# EAGLE design First_Board (EAGLE 6.0)
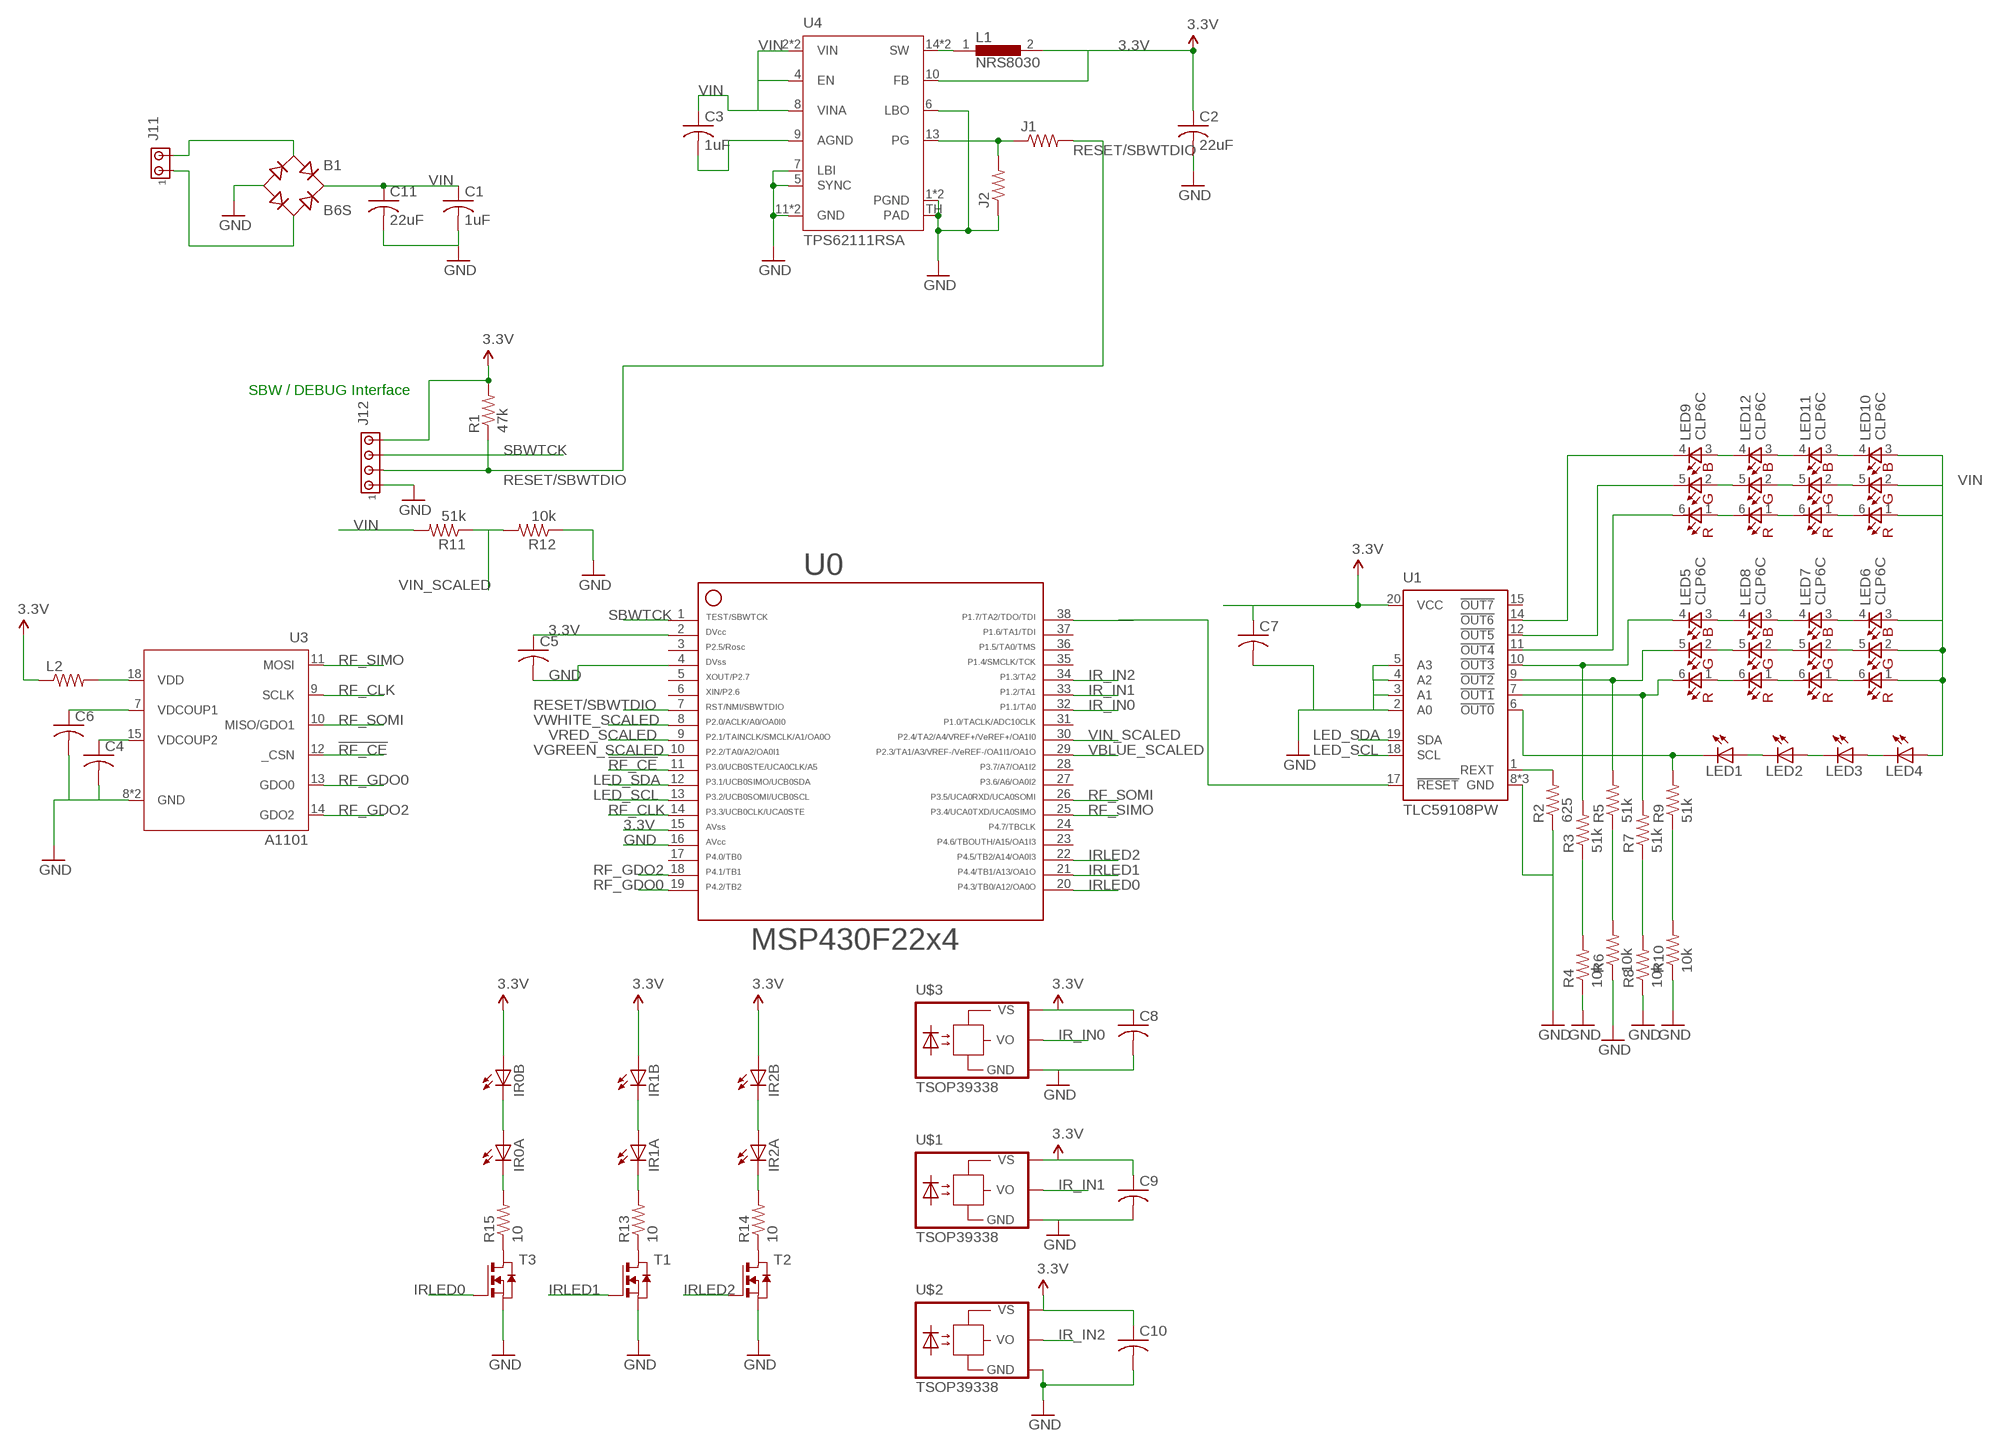
[diagram p0: schematic, sheet 1]

## Parts
B1  B6S  [MBS]
C1  1uF  C-USC0805  [C0805]
C2  22uF  C-USC0805  [C0805]
C3  1uF  C-USC0603  [C0603]
C4  C-USC0603  [C0603]
C5  C-USC0603  [C0603]
C6  C-USC0603  [C0603]
C7  C-USC0603  [C0603]
C8  C-USC0603  [C0603]
C9  C-USC0603  [C0603]
C10  C-USC0603  [C0603]
C11  22uF  C-USC1210  [C1210]
IR0A  LED5MM  [LED5MM]
IR0B  LED5MM  [LED5MM]
IR1A  LED5MM  [LED5MM]
IR1B  LED5MM  [LED5MM]
IR2A  LED5MM  [LED5MM]
IR2B  LED5MM  [LED5MM]
J1  R-US_R0603  [R0603]
J2  R-US_R0603  [R0603]
J11  MTA02-100  [10X02MTA]
J12  MTA04-100  [10X04MTA]
L1  NRS8030  [NRS8030]
L2  R-US_R0603  [R0603]
LED1  LED-2AC-SUPERFLUX  [SUPERFLUX-7.6X7.6]
LED2  LED-2AC-SUPERFLUX  [SUPERFLUX-7.6X7.6]
LED3  LED-2AC-SUPERFLUX  [SUPERFLUX-7.6X7.6]
LED4  LED-2AC-SUPERFLUX  [SUPERFLUX-7.6X7.6]
LED5  CLP6C  [CLP6C]
LED6  CLP6C  [CLP6C]
LED7  CLP6C  [CLP6C]
LED8  CLP6C  [CLP6C]
LED9  CLP6C  [CLP6C]
LED10  CLP6C  [CLP6C]
LED11  CLP6C  [CLP6C]
LED12  CLP6C  [CLP6C]
R1  47k  R-US_R0603  [R0603]
R2  625  R-US_R0603  [R0603]
R3  51k  R-US_R0603  [R0603]
R4  10k  R-US_R0603  [R0603]
R5  51k  R-US_R0603  [R0603]
R6  10k  R-US_R0603  [R0603]
R7  51k  R-US_R0603  [R0603]
R8  10k  R-US_R0603  [R0603]
R9  51k  R-US_R0603  [R0603]
R10  10k  R-US_R0603  [R0603]
R11  51k  R-US_R0603  [R0603]
R12  10k  R-US_R0603  [R0603]
R13  10  R-US_R0603  [R0603]
R14  10  R-US_R0603  [R0603]
R15  10  R-US_R0603  [R0603]
T1  NMOSSOT23  [SOT-23]
T2  NMOSSOT23  [SOT-23]
T3  NMOSSOT23  [SOT-23]
U0  F22X4---DA38  [DA38]
U1  TLC59108PW  [PW_R-PDSO-G20]
U3  A1101  [A1101]
U4  TPS62111RSA  [S-PVQFN-N16]
U$1  TSOP39338  [TSOP39338]
U$2  TSOP39338  [TSOP39338]
U$3  TSOP39338  [TSOP39338]

## Nets
3.3V: C2.1 C5.1 C7.1 C8.1 C9.1 C10.1 IR0B.A IR1B.A IR2B.A J12.4 L1.2 L2.1 R1.2 U0.2 U0.15 U1.20(VCC) U4.10(FB) U$1.VS U$2.VS U$3.VS
!RF_CE: U0.11 U3.12(_CSN)
BLUE: LED5.4(BC) R3.2 U1.10(!OUT3)
BLUE2: LED9.4(BC) U1.14(!OUT6)
GND: B1.- C1.2 C2.2 C4.2 C5.2 C6.2 C7.2 C8.2 C9.2 C10.2 C11.2 J2.1 J12.1 R2.1 R4.1 R6.1 R8.1 R10.1 R12.1 T1.2(S) T2.2(S) T3.2(S) U0.4 U0.16 U1.2(A0) U1.3(A1) U1.4(A2) U1.5(A3) U1.8(GND) U1.13(GND) U1.16(GND) U3.8(GND) U3.17(GND) U4.1(PGND) U4.5(SYNC) U4.6(LBO) U4.7(LBI) U4.11(GND) U4.12(GND) U4.16(PGND) U4.TH(PAD) U$1.GND U$2.GND U$3.GND
GREEN: LED5.5(GC) R5.2 U1.9(!OUT2)
GREEN2: LED9.5(GC) U1.12(!OUT5)
IR_IN0: U0.32 U$3.OUT(VO)
IR_IN1: U0.33 U$1.OUT(VO)
IR_IN2: U0.34 U$2.OUT(VO)
IRLED0: T3.3(G) U0.20
IRLED1: T1.3(G) U0.21
IRLED2: T2.3(G) U0.22
LED_SCL: U0.13 U1.18(SCL)
LED_SDA: U0.12 U1.19(SDA)
N$1: L1.1 U4.14(SW) U4.15(SW)
N$2: IR2A.K(C) R14.2
N$3: IR2A.A IR2B.K(C)
N$4: IR1A.A IR1B.K(C)
N$5: IR1A.K(C) R13.2
N$6: R13.1 T1.1(D)
N$7: U0.38
N$8: C3.2 U4.9(AGND)
N$9: R14.1 T2.1(D)
N$10: LED1.1(C) LED1.3(C) R9.2 U1.6(!OUT0)
N$12: LED9.3(BA) LED12.4(BC)
N$13: LED11.4(BC) LED12.3(BA)
N$14: LED10.4(BC) LED11.3(BA)
N$15: LED10.5(GC) LED11.2(GA)
N$16: LED11.5(GC) LED12.2(GA)
N$17: LED9.2(GA) LED12.5(GC)
N$18: LED9.1(RA) LED12.6(RC)
N$19: R2.2 U1.1(REXT)
N$20: LED11.6(RC) LED12.1(RA)
N$21: LED10.6(RC) LED11.1(RA)
N$22: IR0A.K(C) R15.2
N$23: IR0A.A IR0B.K(C)
N$24: R15.1 T3.1(D)
N$25: LED5.3(BA) LED8.4(BC)
N$26: LED7.4(BC) LED8.3(BA)
N$27: LED6.4(BC) LED7.3(BA)
N$28: LED6.5(GC) LED7.2(GA)
N$29: LED7.5(GC) LED8.2(GA)
N$30: LED5.2(GA) LED8.5(GC)
N$31: LED5.1(RA) LED8.6(RC)
N$32: LED7.6(RC) LED8.1(RA)
N$33: LED6.6(RC) LED7.1(RA)
N$34: LED1.2(A) LED1.4(A) LED2.1(C) LED2.3(C)
N$35: LED2.2(A) LED2.4(A) LED3.1(C) LED3.3(C)
N$36: LED3.2(A) LED3.4(A) LED4.1(C) LED4.3(C)
N$38: U1.17(!RESET)
N$39: B1.AC1 J11.2
N$40: B1.AC2 J11.1
N$42: L2.2 U3.18(VDD)
PG: J1.1 J2.2 U4.13(PG)
RED: LED5.6(RC) R7.2 U1.7(!OUT1)
RED2: LED9.6(RC) U1.11(!OUT4)
RESET/SBWTDIO: J1.2 J12.2 R1.1 U0.7
RF_CLK: U0.14 U3.9(SCLK)
RF_GDO0: U0.19 U3.13(GDO0)
RF_GDO2: U0.18 U3.14(GDO2)
RF_SIMO: U0.25 U3.11(MOSI)
RF_SOMI: U0.26 U3.10(MISO/GDO1)
SBWTCK: J12.3 U0.1
VBLUE_SCALED: R3.1 R4.2 U0.29
VDCOUP1: C6.1 U3.7(VDCOUP1)
VDCOUP2: C4.1 U3.15(VDCOUP2)
VGREEN_SCALED: R5.1 R6.2 U0.10
VIN: B1.+ C1.1 C3.1 C11.1 LED4.2(A) LED4.4(A) LED6.1(RA) LED6.2(GA) LED6.3(BA) LED10.1(RA) LED10.2(GA) LED10.3(BA) R11.2 U4.2(VIN) U4.3(VIN) U4.4(EN) U4.8(VINA)
VIN_SCALED: R11.1 R12.2 U0.30
VRED_SCALED: R7.1 R8.2 U0.9
VWHITE_SCALED: R9.1 R10.2 U0.8
Unconnected: U0.3 U0.5 U0.6 U0.17 U0.23 U0.24 U0.27 U0.28 U0.31 U0.35 U0.36 U0.37 U1.15(!OUT7)

## Notes on the sheet
- SBW / DEBUG Interface

## Library data of the parts
B1 = rectifier:B*S: Surface Mount Glass Passivated Bridge Rectifiers Source: Comchip Bridge Rectifiers B05S-G_B10S-G.pdf
C1-C11 = rcl:C-US: CAPACITOR, American symbol
IR0A IR0B IR1A IR1B IR2A IR2B = led:LED: LED OSRAM: - CHIPLED LG R971, LG N971, LY N971, LG Q971, LY Q971, LO R971, LY R971 LH N974, LH R974 LS Q976, LO Q976, LY Q976 LO Q996 - Hyper CHIPLED LW Q18S LB Q993, LB Q99A, LB R99A - SideLED LS A670, LO A670, LY A670, LG A670, LP A670 LB A673, LV A673, LT A673, LW A673 LH A674 LY A675 LS A676, LA A676, LO A676, LY A676, LW A676 LS A679, LY A679, LG A679 - Hyper Micro SIDELED® LS Y876, LA Y876, LO Y876, LY Y876 LT Y87S - SmartLED LW L88C, LW L88S LB L89C, LB L89S, LG L890 LS L89K, LO L89K, LY L89K LS L896, LA L896, LO L896, LY L896 - TOPLED LS T670, LO T670, LY T670, LG T670, LP T670 LSG T670, LSP T670, LSY T670, LOP T670, LYG T670 LG T671, LOG T671, LSG T671 LB T673, LV T673, LT T673, LW T673 LH T674 LS T676, LA T676, LO T676, LY T676, LB T676, LH T676, LSB T676, LW T676 LB T67C, LV T67C, LT T67C, LS T67K, LO T67K, LY T67K, LW E67C LS E67B, LA E67B, LO E67B, LY E67B, LB E67C, LV E67C, LT E67C LW T67C LS T679, LY T679, LG T679 LS T770, LO T770, LY T770, LG T770, LP T770 LB T773, LV T773, LT T773, LW T773 LH T774 LS E675, LA E675, LY E675, LS T675 LS T776, LA T776, LO T776, LY T776, LB T776 LHGB T686 LT T68C, LB T68C - Hyper Mini TOPLED® LB M676 - Mini TOPLED Santana® LG M470 LS M47K, LO M47K, LY M47K Source: http://www.osram.convergy.de LUXEON: - LUMILED® LXK2-PW12-R00, LXK2-PW12-S00, LXK2-PW14-U00, LXK2-PW14-V00 LXK2-PM12-R00, LXK2-PM12-S00, LXK2-PM14-U00 LXK2-PE12-Q00, LXK2-PE12-R00, LXK2-PE12-S00, LXK2-PE14-T00, LXK2-PE14-U00 LXK2-PB12-K00, LXK2-PB12-L00, LXK2-PB12-M00, LXK2-PB14-N00, LXK2-PB14-P00, LXK2-PB14-Q00 LXK2-PR12-L00, LXK2-PR12-M00, LXK2-PR14-Q00, LXK2-PR14-R00 LXK2-PD12-Q00, LXK2-PD12-R00, LXK2-PD12-S00 LXK2-PH12-R00, LXK2-PH12-S00 LXK2-PL12-P00, LXK2-PL12-Q00, LXK2-PL12-R00 Source: www.luxeon.com KINGBRIGHT: KA-3528ASYC Source: www.kingbright.com
J1 J2 L2 R1-R15 = rcl:R-US_: RESISTOR, American symbol
J11 = con-amp:MTA02-100: AMP connector
J12 = con-amp:MTA04-100: AMP connector
L1 = inductors:NRS8030
LED1-LED4 = led:LED-2AC-: LEDs with 2 Cathode & 2 Anode - Kingbright SUPER FLUX LED LAMP Source: www.us.kingbright.com/images/catalog/SPEC/W7676CPBC-H.pdf Cree® P4 LED CP41B-WES/WGS Source: Data sheet <http://www.cree.com/products/pdf/LEDlamps/CP41B-WES&WGS.pdf>
LED5-LED12 = led:CLP6C
T1-T3 = zetex:NMOSSOT23: MOS FET; OC_FARNELL: unknown; OC_NEWARK: unknown
U0 = TI_MSP430_v16:F22X4---DA38: ***MSP430F22x4***DA38
U1 = texas:TLC59108
U3 = anaren:A1101
U4 = texas2:TPS62111: TPS62111 3.3v Buck Regulator (5.5-17V input)
U$1-U$3 = opto-vishay:TSOP39338

## Board
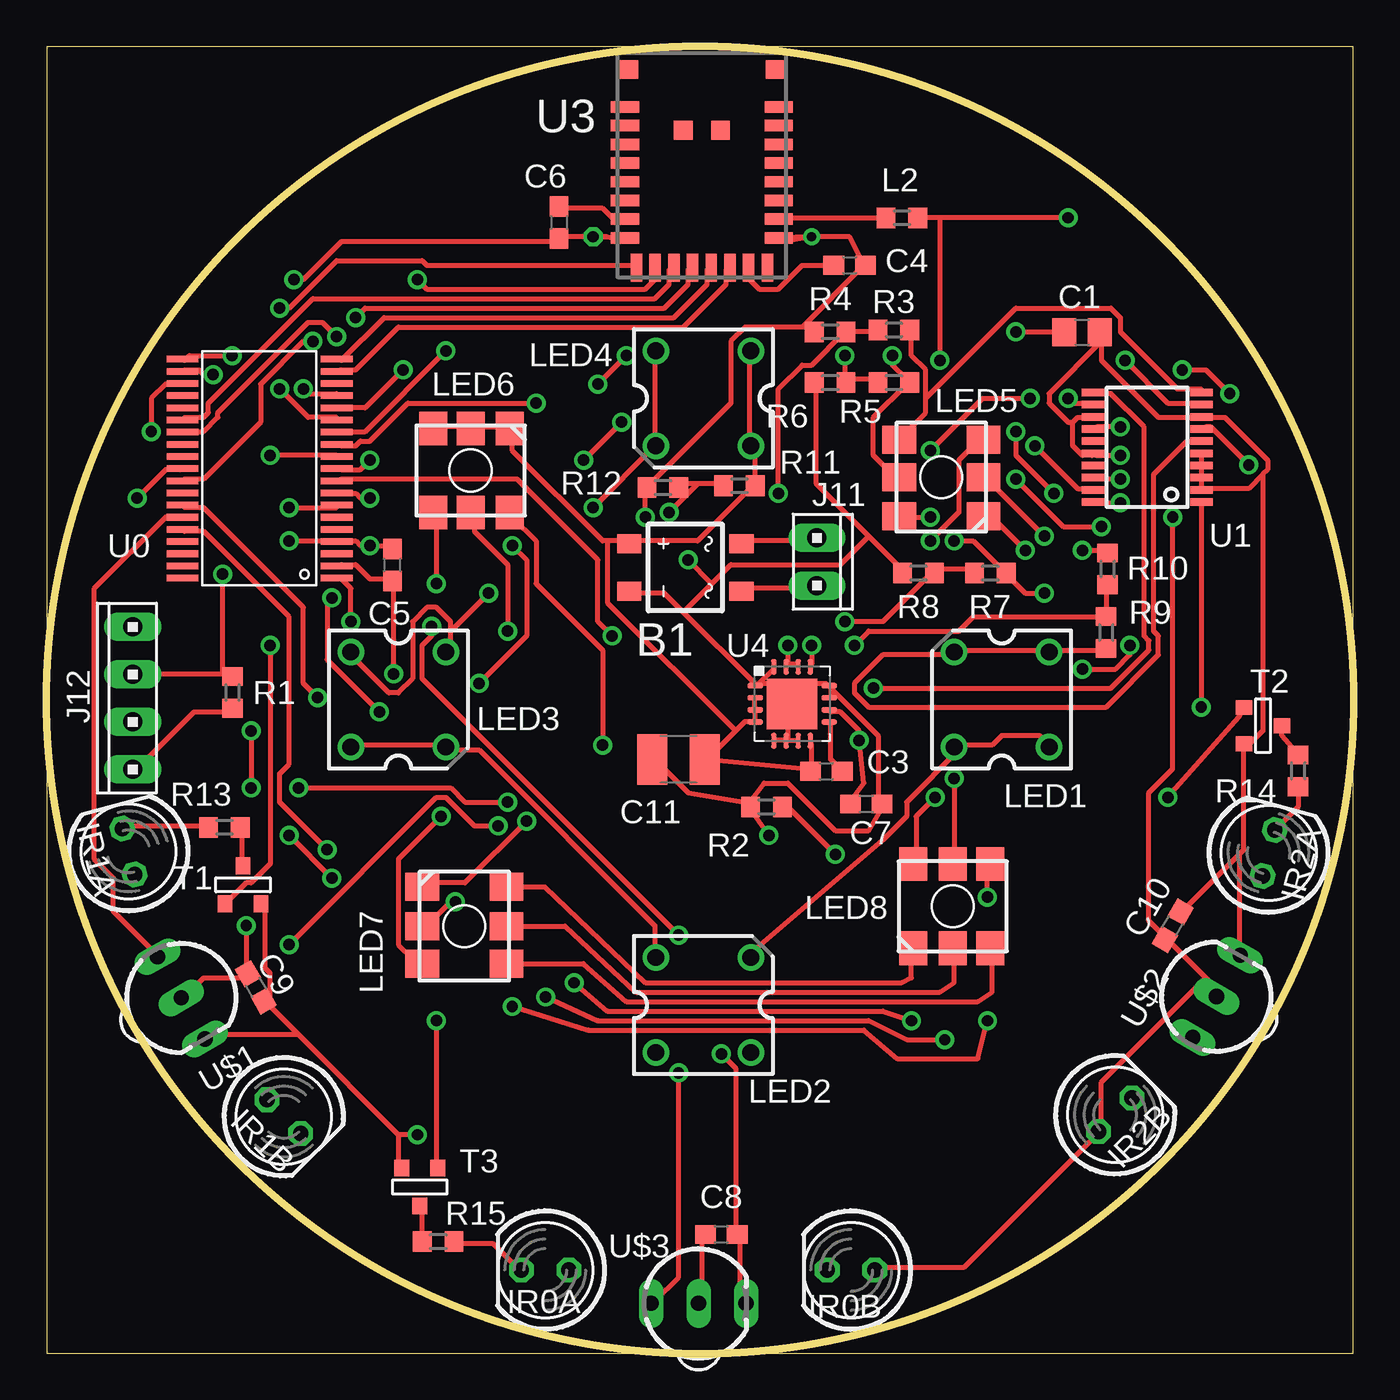
[diagram p1: board, top side]
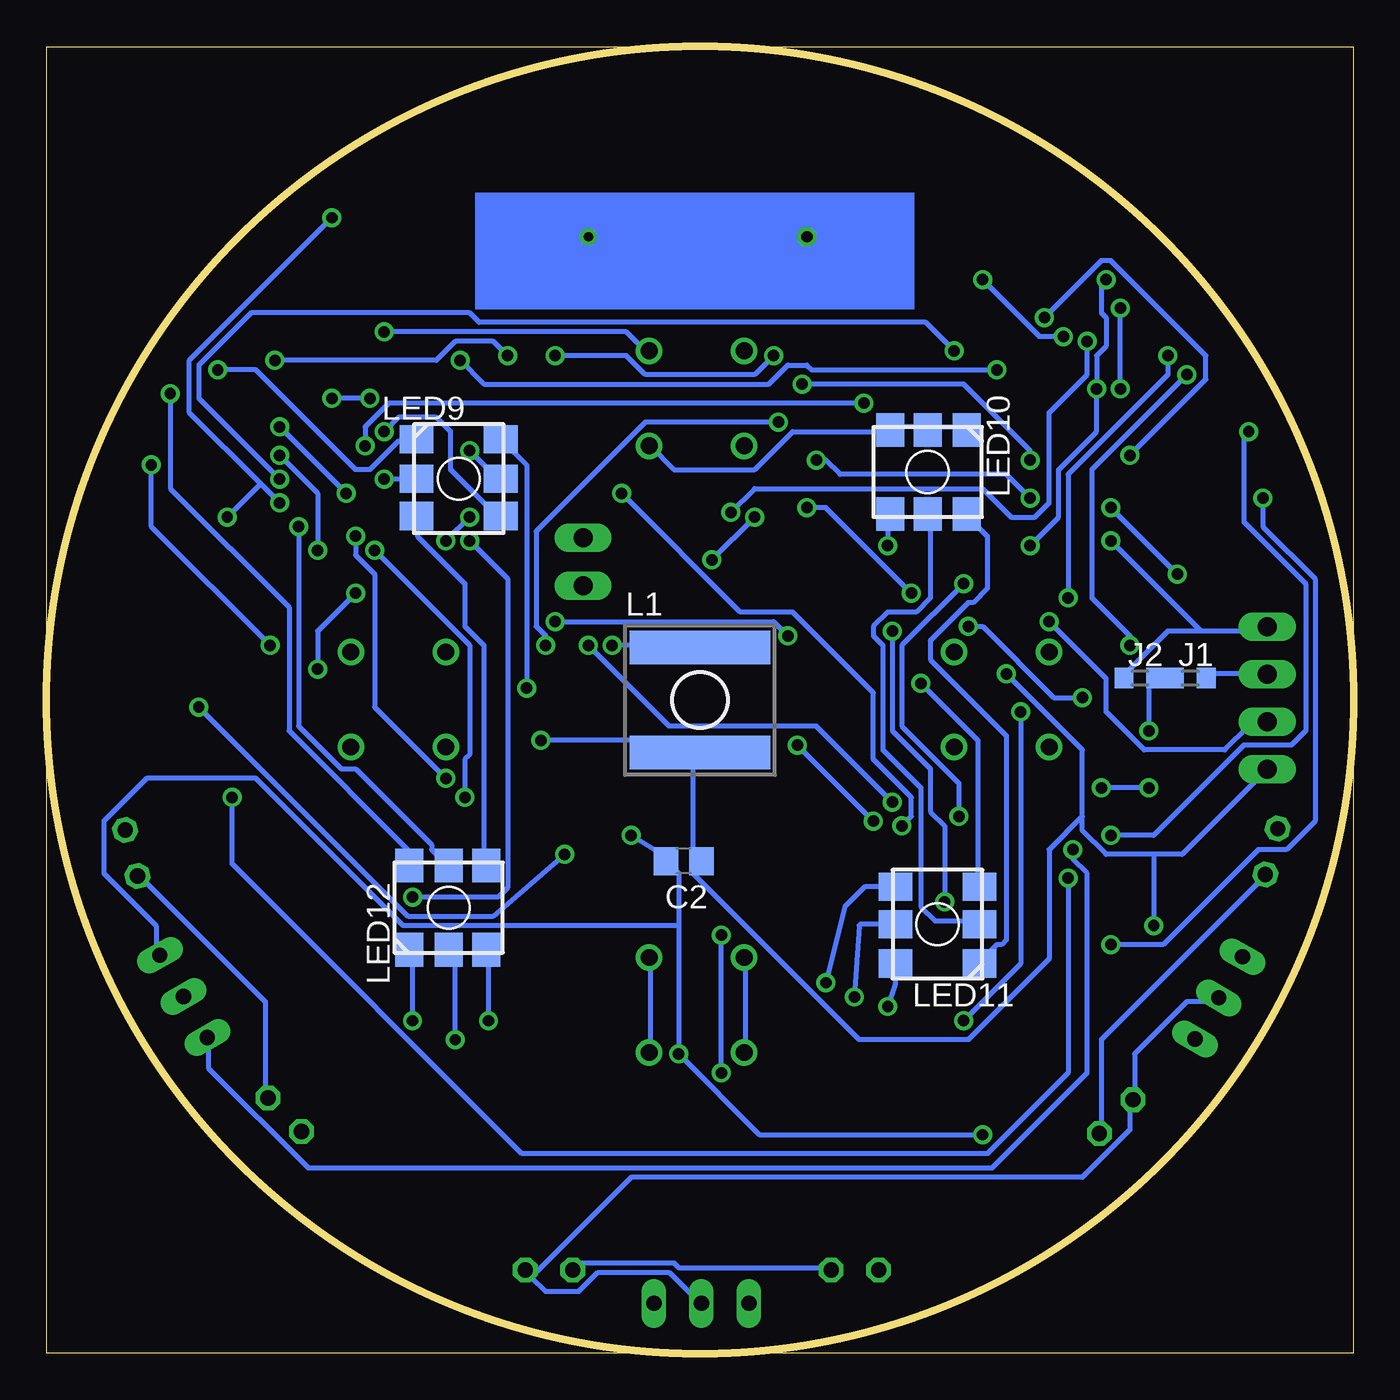
[diagram p2: board, bottom side, seen from below]

Size 69.85 x 69.85 mm. Coordinates in mm from the lower left corner, seen from the top.
Outline: 0,0 69.85,0 69.85,69.85 0,69.85 0,0
Outline: circle at 34.92,34.92 radius 34.92
Copper layers (1*16): Top 0.035mm / dielectric 1.5mm / Bottom 0.035mm
Design rules: minimum track width 10mil, minimum drill 24mil, track to track 8mil, track to pad 8mil, pad to pad 8mil, via to via 8mil, smd to smd 8mil, copper to edge 40mil, drill to drill 10mil, minimum pad ring 10mil, minimum via ring 8mil, stop-mask expansion 0mil, vias tented up to drill 0mil, thermal gap 10mil
bRestrict: area 13,62.2 to 56.4,70.1

### Footprints (pad centres in the part's own frame; a part is rotated, then mirrored left to right if it is on the bottom)
MBS = smd 1 x 1.3: + -1.27,-3; - 1.27,-3; AC1 -1.27,3; AC2 1.27,3
C0805 = smd 1.3 x 1.5: 1 -0.95,0; 2 0.95,0
C0603 = smd 1.1 x 1: 1 -0.85,0; 2 0.85,0
C1210 = smd 1.6 x 2.7: 1 -1.4,0; 2 1.4,0
LED5MM = drill 0.813 octagon: A -1.27,0; K 1.27,0
R0603 = smd 1 x 1.1: 1 -0.85,0; 2 0.85,0
10X02MTA = drill 1.016 long: 1 1.27,0; 2 -1.27,0
10X04MTA = drill 1.016 long: 1 3.81,0; 2 1.27,0; 3 -1.27,0; 4 -3.81,0
NRS8030 = smd 7.5 x 1.8: 1 0,2.8; 2 0,-2.8
SUPERFLUX-7.6X7.6 = drill 0.9 pad 1.422: 1 -2.54,2.54; 2 2.54,2.54; 3 -2.54,-2.54; 4 2.54,-2.54
CLP6C = smd 1.8 x 1.5: 1 -2.25,2.1; 2 -2.25,0; 3 -2.25,-2; 4 2.25,-2; 5 2.25,0; 6 2.25,2.1
SOT-23 = smd 0.787 x 0.889: 1 0.025,-1.016; 2 -0.94,1.016; 3 0.991,1.016
DA38 = smd 0.35 x 1.705: 1 -5.85,-4.12; 2 -5.2,-4.12; 3 -4.55,-4.12; 4 -3.9,-4.12; 5 -3.25,-4.12; 6 -2.6,-4.12; 7 -1.95,-4.12; 8 -1.3,-4.12; 9 -0.65,-4.12; 10 0,-4.12; 11 0.65,-4.12; 12 1.3,-4.12; 13 1.95,-4.12; 14 2.6,-4.12; 15 3.25,-4.12; 16 3.9,-4.12; 17 4.55,-4.12; 18 5.2,-4.12; 19 5.85,-4.12; 20 5.85,4.12; 21 5.2,4.12; 22 4.55,4.12; 23 3.9,4.12; 24 3.25,4.12; 25 2.6,4.12; 26 1.95,4.12; 27 1.3,4.12; 28 0.65,4.12; 29 0,4.12; 30 -0.65,4.12; 31 -1.3,4.12; 32 -1.95,4.12; 33 -2.6,4.12; 34 -3.25,4.12; 35 -3.9,4.12; 36 -4.55,4.12; 37 -5.2,4.12; 38 -5.85,4.12
PW_R-PDSO-G20 = smd 0.4 x 1.2: 1 -2.925,-2.9; 2 -2.275,-2.9; 3 -1.625,-2.9; 4 -0.975,-2.9; 5 -0.325,-2.9; 6 0.325,-2.9; 7 0.975,-2.9; 8 1.625,-2.9; 9 2.275,-2.9; 10 2.925,-2.9; 11 2.925,2.9; 12 2.275,2.9; 13 1.625,2.9; 14 0.975,2.9; 15 0.325,2.9; 16 -0.325,2.9; 17 -0.975,2.9; 18 -1.625,2.9; 19 -2.275,2.9; 20 -2.925,2.9
A1101 = smd 1.5 x 0.61: 1 -4.11,2.6; 2 -4.11,1.6; 3 -4.11,0.6; 4 -4.11,-0.4; 5 -4.11,-1.4; 6 -4.11,-2.4; 7 -4.11,-3.4; 8 -4.11,-4.4; 17 4.11,-4.4; 18 4.11,-3.4; 19 4.11,-2.4; 20 4.11,-1.4; 21 4.11,-0.4; 22 4.11,0.6; 23 4.11,1.6; 24 4.11,2.6 | smd 0.61 x 1.5: 9 -3.5,-6; 10 -2.5,-6; 11 -1.5,-6; 12 -0.5,-6; 13 0.5,-6; 14 1.5,-6; 15 2.5,-6; 16 3.5,-6 | smd 1 x 1: MECH1 -3.91,4.6; MECH2 -1,1.35; MECH3 1,1.35; MECH4 3.91,4.6
S-PVQFN-N16 = smd 0.85 x 0.3: 1 -1.975,0.975; 2 -1.975,0.325; 3 -1.975,-0.325; 4 -1.975,-0.975; 9 1.975,-0.975; 10 1.975,-0.325; 11 1.975,0.325; 12 1.975,0.975 | smd 0.3 x 0.85: 5 -0.975,-1.975; 6 -0.325,-1.975; 7 0.325,-1.975; 8 0.975,-1.975; 13 0.975,1.975; 14 0.325,1.975; 15 -0.325,1.975; 16 -0.975,1.975 | smd 2.7 x 2.7: TH 0,0
TSOP39338 = drill 0.813 long: GND 2.54,0; OUT -2.54,0; VS 0,0

### Placement (x,y rotation side)
B1  34.14,42.01 270 top
C1  55.35,54.58 0 top
C2  35.79,26.31 180 bottom
C3  41.68,31.11 0 top
C4  42.93,58.17 0 top
C5  18.49,42.14 90 top
C6  27.38,60.45 270 top
C7  43.81,29.36 0 top
C8  36.07,6.35 0 top
C9  11.18,19.56 300 top
C10  60.2,22.86 60 top
C11  33.78,31.75 180 top
IR0A  26.64,4.45 180 top
IR0B  43,4.45 180 top
IR1A  4.37,26.82 105 top
IR1B  12.67,12.65 315 top
IR2A  65.33,26.75 75 top
IR2B  57.12,12.75 45 top
J1  8.71,36.09 0 bottom
J2  11.4,36.09 0 bottom
J11  41.17,42.32 270 top
J12  4.6,35.03 90 top
L1  34.92,34.92 0 bottom
L2  45.72,60.71 180 top
LED1  51.05,34.95 270 top
LED2  35.1,18.62 180 top
LED3  18.8,34.95 90 top
LED4  35.1,51.05 0 top
LED5  47.83,46.84 180 top
LED6  22.66,47.19 270 top
LED7  22.33,22.83 0 top
LED8  48.44,23.9 90 top
LED9  47.83,46.76 0 bottom
LED10  22.76,47.12 270 bottom
LED11  22.23,22.94 180 bottom
LED12  48.36,23.83 90 bottom
R1  9.93,35.33 270 top
R2  38.48,29.21 0 top
R3  45.29,54.71 0 top
R4  41.88,54.61 0 top
R5  45.29,51.89 0 top
R6  41.88,51.89 0 top
R7  50.44,41.71 0 top
R8  46.61,41.71 0 top
R9  56.64,38.53 270 top
R10  56.72,41.94 270 top
R11  37.03,46.38 0 top
R12  32.94,46.28 0 top
R13  9.5,28.12 180 top
R14  66.9,31.14 270 top
R15  20.93,5.97 0 top
T1  10.52,25.04 180 top
T2  65.02,33.53 90 top
T3  19.91,8.89 0 top
U0  11.38,47.29 90 top
U1  58.83,48.44 90 top
U3  35.03,64.03 0 top
U4  39.85,34.72 0 top
U$1  7.19,19 300 top
U$2  62.53,19.08 60 top
U$3  34.85,2.67 0 top

### Tracks (layer width: path | path; a pad name or v marks a point on that pad's centre or on a via)
3.3V  (via drill 0.61)
  Top 0.254: v54.61,60.71 47.75,60.71 | 47.75,60.71 L2.1 | v57.4,45.47 56.13,45.47 U1.20 | v19.05,52.58 17.02,50.55 15.75,50.55 U0.15 | 47.75,60.71 v47.75,53.09 | 61.98,20.07 62.74,19.3 U$2.VS 61.98,20.07 | 61.98,20.07 59.94,22.1 C10.1 59.69,22.35 58.93,23.11 58.93,29.97 60.2,31.24 v60.2,44.7 | C8.1 35.05,6.35 35.05,2.79 U$3.VS | IR0B.A 44.45,4.57 49.02,4.57 56.13,11.68 IR2B.A 56.39,11.94 56.39,14.48 61.98,20.07 | U4.10 41.91,34.29 42.42,34.29 43.43,33.27 v43.43,32.77 43.69,30.48 42.93,29.46 C7.1 | U$1.VS 7.37,19.05 8.38,20.07 10.67,20.07 C9.1 10.67,20.32 v10.67,22.86 | U0.2 15.75,42.16 16.51,42.16 17.27,41.4 18.29,41.4 C5.1 18.54,41.15 v18.54,36.32 | R1.2 9.91,34.29 7.87,34.29 4.83,31.24 J12.4
  Bottom 0.254: v54.61,60.71 62.23,53.09 62.23,50.29 58.42,46.48 | v57.4,45.47 58.42,46.48 | v19.05,52.58 28.96,52.58 29.21,52.83 30.23,52.83 31.24,51.82 46.48,51.82 v47.75,53.09 | 43.94,4.06 44.2,4.32 IR0B.A 43.94,4.06 | 43.94,4.06 43.18,3.3 41.4,3.3 40.39,4.32 36.58,4.32 35.05,2.79 U$3.VS | v43.43,32.77 35.56,32.77 35.05,32.26 L1.2 35.05,32 35.31,31.75 35.31,26.92 C2.1 35.31,26.67 35.31,25.65 26.42,16.76 20.57,16.76 16.26,21.08 16.26,26.92 14.48,28.7 | U$1.VS 7.37,18.8 8.89,18.8 11.68,16 11.68,13.72 IR1B.A 11.94,13.46 11.94,11.94 14.48,9.4 38.61,9.4 43.94,4.06 | v18.54,36.32 14.48,32.26 14.48,28.7 | 14.48,28.7 14.48,27.94 13.21,26.67 10.67,26.67 | 10.67,26.67 9.14,26.67 J12.4 | 10.67,26.67 v10.67,22.86 | v60.2,44.7 58.42,46.48
!RF_CE  (via drill 0.61)
  Top 0.254: v16.51,55.37 17.02,55.88 33.02,55.88 34.29,57.15 34.29,57.91 U3.12 | v11.94,48.01 15.49,48.01 U0.11
  Bottom 0.254: v16.51,55.37 13.46,58.42 12.95,58.42 7.87,53.34 7.87,52.07 v11.94,48.01
BLUE
  Top 0.254: 46.99,51.05 46.99,50.29 45.72,49.02 LED5.4 | 46.99,51.05 46.99,52.58 46.23,53.34 46.23,54.61 R3.2 | 46.99,51.05 51.82,55.88 56.9,55.88 57.4,55.37 57.4,54.61 60.45,51.56 61.72,51.56 U1.10
BLUE2  (via drill 0.61)
  Top 0.254: v57.4,49.53 56.13,49.53 U1.14 | v53.85,45.97 51.82,48.01 v51.82,49.28
  Bottom 0.254: v53.85,45.97 v57.4,49.53 | v51.82,49.28 51.05,50.04 49.02,50.04 48.26,49.28 48.26,47.24 45.72,44.7 LED9.4
GND  (via drill 0.5, 0.6, 0.61)
  Top 0.254: C5.2 18.29,43.18 v17.27,43.18 16.76,43.18 16.51,43.43 15.75,43.43 U0.4 15.49,43.43 v12.95,43.43 | v13.72,51.56 13.97,51.31 15.49,51.31 U0.16 | v29.21,59.69 29.97,59.69 U3.8 v29.21,59.69 | v29.21,59.69 27.43,59.69 C6.2 27.18,59.44 15.75,59.44 13.72,57.4 v13.21,57.4 | 40.39,54.86 40.64,54.86 40.89,54.61 R4.1 | 40.39,54.86 37.34,54.86 36.58,54.1 36.58,50.8 32.26,46.48 R12.1 32,46.23 v32,44.7 | 40.39,54.86 43.69,58.17 | v40.89,59.69 39.37,59.44 U3.17 v40.89,59.69 | 43.69,58.17 42.93,59.69 v40.89,59.69 | 43.69,58.17 C4.2 | 43.94,43.69 45.72,41.91 R8.1 | 43.94,43.69 41.15,46.48 41.15,51.82 R6.1 | 39.62,32.77 38.86,32.77 U4.5 | 39.62,32.77 40.13,32.77 U4.7 | 39.62,32.77 39.62,34.54 U4.TH 39.88,34.8 39.88,35.81 | 39.62,32.77 U4.6 | 41.91,35.56 41.91,35.05 U4.11 | 38.1,35.81 38.86,36.58 U4.16 | 38.1,35.81 39.88,35.81 | 39.88,35.81 41.66,35.81 U4.12 41.91,35.56 | 38.1,35.81 U4.1 37.85,35.81 34.04,39.62 | 41.91,35.56 44.45,33.02 44.45,29.46 C7.2 44.7,29.21 43.94,27.94 42.16,27.94 39.62,30.48 38.35,30.48 37.59,29.46 | 34.04,39.62 33.02,40.64 31.24,40.64 B1.- | 43.94,43.69 42.42,42.16 36.58,42.16 35.56,41.15 | 34.04,39.62 35.56,41.15 | 35.56,41.15 v34.29,42.42 | 63.75,26.67 60.71,23.62 C10.2 | 63.75,26.67 64.01,26.92 T2.2 64.01,32.26 65.02,33.27 65.02,46.99 | 63.75,26.67 63.75,21.34 U$2.GND | v55.37,42.93 56.64,42.93 R10.1 | v57.4,48.01 56.13,48.01 U1.16 55.88,48.01 55.37,48.01 54.86,48.51 54.86,49.78 | 54.86,49.78 55.12,50.04 55.88,50.04 U1.13 | 61.72,47.5 61.72,48.01 U1.5 | 61.72,47.5 61.72,46.99 U1.3 61.72,46.74 61.72,46.23 U1.2 61.98,46.23 64.26,46.23 65.02,46.99 | 61.72,47.5 U1.4 | 56.39,54.1 56.39,54.36 C1.2 56.39,54.1
  Top 0.254: 56.39,54.1 56.39,53.09 59.44,50.04 61.72,50.04 U1.8 61.98,50.04 62.99,50.04 65.28,47.75 65.28,47.24 65.02,46.99 | 54.86,49.78 54.61,49.78 53.59,50.8 53.59,51.31 56.39,54.1 | 18.8,11.68 18.8,9.91 T3.2 | 11.94,18.54 11.68,18.8 C9.2 11.94,18.54 | 11.94,18.54 13.46,17.02 | 13.46,17.02 18.8,11.68 | 11.94,18.54 11.94,20.32 11.68,20.57 11.68,23.88 T1.2 | 13.46,17.02 8.64,17.02 U$1.GND | U$3.GND 37.34,2.79 37.08,3.05 37.08,6.35 C8.2 36.83,6.35 36.83,15.24 v36.07,16 | 37.34,29.46 34.29,29.97 32.51,31.75 C11.2 | 37.34,29.46 v38.61,27.69 | 37.34,29.46 37.59,29.46 | v19.81,11.68 18.8,11.68 | 37.59,29.46 R2.1
  Bottom 0.254: v17.27,43.18 15.75,44.7 15.75,47.24 13.72,49.28 v13.72,51.56 13.72,53.34 13.21,53.85 13.21,55.37 13.46,55.63 13.46,57.15 v13.21,57.4 | 8.13,38.61 4.83,38.61 J12.1 | 8.13,38.61 9.91,38.61 12.19,36.32 J2.1 | 8.13,38.61 v12.95,43.43 | v40.89,59.69 v29.21,59.69 | v34.29,42.42 v32,44.7 | v55.37,42.93 55.37,45.97 v57.4,48.01 | v38.61,27.69 37.34,26.92 C2.2 37.08,26.67 36.07,25.65 36.07,22.86 | 36.07,22.86 v36.07,16 31.75,11.68 v19.81,11.68 | 36.07,22.86 50.8,22.86 58.67,30.73 64.52,30.73 66.8,28.45 66.8,25.65 64.01,22.86 64.01,21.34 U$2.GND
GREEN  (via drill 0.61)
  Top 0.254: LED5.5 45.47,46.74 44.2,48.01 44.2,50.04 45.97,51.82 R5.2 45.97,52.07 45.21,52.83 v45.21,53.34 | v57.66,53.09 59.94,50.8 61.72,50.8 U1.9
  Bottom 0.254: v57.66,53.09 49.02,53.09 48.01,54.1 45.97,54.1 v45.21,53.34
GREEN2  (via drill 0.61)
  Top 0.254: v54.61,51.05 54.86,50.8 55.88,50.8 U1.12 | v52.58,51.05 50.04,51.05 v47.24,48.26
  Bottom 0.254: v52.58,51.05 v54.61,51.05 | v47.24,48.26 45.72,46.74 LED9.5
IR_IN0  (via drill 0.61)
  Top 0.254: v14.48,35.05 13.72,35.81 13.72,39.88 8.38,45.21 7.37,45.21 U0.32 | v20.57,38.86 20.57,38.35 20.07,37.85 20.07,36.07 v33.78,22.35 | v33.78,14.99 33.78,4.06 32.51,2.79 U$3.OUT
  Bottom 0.254: v14.48,35.05 16,35.05 19.81,38.86 v20.57,38.86 | v33.78,14.99 v33.78,22.35
IR_IN1
  Top 0.254: U0.33 7.11,44.7 6.35,44.7 2.54,40.89 2.54,26.42 3.56,25.4 3.56,23.62 5.84,21.34 U$1.OUT
IR_IN2  (via drill 0.61)
  Top 0.254: v14.99,26.92 12.45,29.46 12.45,30.99 12.95,31.5 12.95,39.37 8.38,43.94 7.37,43.94 U0.34
  Bottom 0.254: v14.99,26.92 14.99,26.42 14.22,25.65 14.22,14.99 19.3,9.91 55.88,9.91 61.21,15.24 61.21,16.76 U$2.OUT
IRLED0  (via drill 0.61)
  Top 0.254: v20.83,17.78 20.83,9.91 T3.3 | v17.78,34.29 14.99,37.08 14.99,40.13 v15.24,40.39 | v9.91,53.34 7.62,53.34 7.37,53.09 U0.20
  Bottom 0.254: v20.83,17.78 17.78,20.83 v17.78,34.29 | v15.24,40.39 15.24,46.99 9.91,52.32 v9.91,53.34
IRLED1  (via drill 0.61)
  Top 0.254: v11.94,37.85 11.94,26.16 10.92,25.15 10.67,25.15 9.65,24.13 T1.3 | v8.89,52.32 8.38,52.32 8.13,52.58 7.37,52.58 U0.21
  Bottom 0.254: v11.94,37.85 11.94,38.35 13.97,40.39 13.97,47.24 v8.89,52.32
IRLED2  (via drill 0.61)
  Top 0.254: v59.94,29.72 63.75,34.04 T2.3 | v12.95,27.69 v15.24,25.4 | v5.59,49.28 5.59,51.05 6.35,51.82 7.11,51.82 U0.22
  Bottom 0.254: v59.94,29.72 59.94,26.16 44.45,10.67 19.56,10.67 15.24,14.99 v15.24,25.4 | v12.95,27.69 10.67,27.69 5.84,32.51 3.3,32.51 2.54,33.27 2.54,41.15 5.84,44.45 5.84,49.02 v5.59,49.28
LED_SCL  (via drill 0.61)
  Top 0.254: v57.4,46.74 56.13,46.74 U1.18 | v21.34,53.59 17.02,49.28 15.75,49.28 U0.13
  Bottom 0.254: v57.4,46.74 61.72,51.05 61.72,52.83 58.93,55.63 47.24,55.63 46.74,55.12 22.86,55.12 v21.34,53.59
LED_SDA  (via drill 0.61)
  Top 0.254: v52.83,48.51 55.12,46.23 55.88,46.23 U1.19 | v26.16,50.8 19.3,50.8 17.27,48.77 16.76,48.77 16.51,48.51 15.75,48.51 U0.12
  Bottom 0.254: v52.83,48.51 52.83,49.53 51.56,50.8 v26.16,50.8
N$1  (via drill 0.61)
  Top 0.254: 39.62,36.83 40.13,36.83 U4.14 | v39.62,37.85 39.62,36.83 | 39.62,36.83 U4.15
  Bottom 0.254: v39.62,37.85 35.05,37.85 L1.1
N$2
  Top 0.254: R14.2 66.9,29.22 IR2A.K
N$3
  Bottom 0.254: IR2B.K 58.17,13.72 58.17,18.8 64.77,25.4 IR2A.A
N$4
  Bottom 0.254: IR1B.K 13.46,11.94 13.46,16.76 4.83,25.4 IR1A.A
N$5
  Top 0.254: R13.2 8.64,28.19 4.06,28.19 IR1A.K
N$6
  Top 0.254: T1.1 10.41,26.16 10.41,27.94 R13.1
N$8
  Top 0.254: U4.9 41.91,33.78 41.91,31.75 42.42,31.24 C3.2
N$9
  Top 0.254: T2.1 66.04,33.02 R14.1
N$10
  Top 0.254: 53.59,37.59 56.64,37.59 R9.2 | U1.6 60.96,48.77 59.18,46.99 59.18,38.61 59.44,38.35 59.44,37.34 56.64,34.54 43.94,34.54 43.18,35.31 43.18,35.81 44.7,37.34 48.51,37.34 LED1.3 48.51,37.59 53.59,37.59 | 53.59,37.59 LED1.1
N$12
  Bottom 0.254: LED12.4 46.48,26.16 46.48,37.85 47.5,38.86 47.5,41.15 50.04,43.69 50.04,44.7 LED9.3
N$13  (via drill 0.6, 0.6 pad 0.25)
  Top 0.254: v28.19,19.81 29.97,18.29 44.7,18.29 v46.23,17.78
  Bottom 0.254: LED11.4 26.12,24.94 27.18,23.88 v28.19,19.81 | v46.23,17.78 46.23,21.44 LED12.3
N$14  (via drill 0.61)
  Top 0.254: v23.11,35.81 25.65,38.35 25.65,42.42 v24.89,43.18
  Bottom 0.254: v23.11,35.81 20.07,32.77 20.07,25.15 LED11.3 | v24.89,43.18 24.89,44.7 LED10.4
N$15
  Bottom 0.254: LED11.2 20.07,23.11 22.35,23.11 23.11,23.88 23.11,30.23 25.15,32.26 25.15,37.85 25.65,38.35 25.65,38.86 24.89,39.62 23.37,39.62 22.61,40.39 22.61,44.7 LED10.5
N$16  (via drill 0.6, 0.6 pad 0.25)
  Top 0.254: v26.67,19.05 29.46,17.78 43.94,17.78 45.97,16.76 v48.01,16.76
  Bottom 0.254: LED11.5 26.34,22.94 26.42,22.86 v26.67,19.05 | v48.01,16.76 48.01,21.22 LED12.2
N$17  (via drill 0.61)
  Top 0.254: v56.39,44.2 54.36,44.2 v51.82,46.74
  Bottom 0.254: v56.39,44.2 56.39,33.53 54.1,31.24 53.34,31.24 49.28,27.18 49.28,26.92 48.51,26.16 LED12.5 | v51.82,46.74 50.29,46.74 LED9.2
N$18  (via drill 0.61)
  Top 0.254: v63.25,51.31 61.98,52.58 v60.71,52.58
  Bottom 0.254: v63.25,51.31 63.25,46.23 56.9,39.88 56.9,33.27 50.55,26.92 50.55,26.16 LED12.6 | v60.71,52.58 58.67,52.58 53.34,47.24 52.58,47.24 51.05,48.77 50.29,48.77 LED9.1
N$19  (via drill 0.61)
  Top 0.254: v42.16,26.67 39.37,29.46 R2.2 | v61.72,34.54 61.72,45.47 U1.1
  Bottom 0.254: v42.16,26.67 45.97,23.37 50.55,23.37 v61.72,34.54
N$20  (via drill 0.6)
  Top 0.254: v24.89,18.54 28.96,17.27 43.69,17.27 45.47,15.75 49.78,15.75 v50.29,17.78
  Bottom 0.254: v50.29,17.78 50.29,21.41 LED12.1 | LED11.6 24.48,19.72 v24.89,18.54
N$21
  Bottom 0.254: LED11.1 19.81,21.08 19.05,21.84 18.8,21.84 18.54,22.1 18.54,33.02 22.61,37.08 22.61,38.1 20.57,40.13 20.32,40.13 19.56,40.89 19.56,43.69 20.57,44.7 LED10.6
N$22
  Top 0.254: R15.2 21.84,5.84 23.88,5.84 25.15,4.57 IR0A.K
N$23
  Bottom 0.254: IR0A.A 27.94,4.57 36.07,4.57 36.32,4.83 41.4,4.83 41.66,4.57 IR0B.K
N$24
  Top 0.254: T3.1 20.07,7.87 20.07,6.1 R15.1
N$25  (via drill 0.61)
  Top 0.254: v50.29,24.38 50.29,25.91 LED8.4 | v47.24,43.43 48.77,44.96 48.77,47.75 50.04,49.02 LED5.3
  Bottom 0.254: v50.29,24.38 45.72,24.38 45.21,24.89 45.21,41.4 v47.24,43.43
N$26
  Top 0.254: LED7.4 28.7,20.84 30.99,18.8 49.78,18.8 50.55,19.3 50.55,21.54 LED8.3
N$27  (via drill 0.61)
  Top 0.254: v21.08,28.7 18.8,26.42 18.8,21.84 19.56,21.08 20.07,21.08 LED7.3 | v20.83,41.15 20.83,44.7 LED6.4
  Bottom 0.254: v21.08,28.7 21.08,30.48 24.13,33.53 24.13,37.85 v20.83,41.15
N$28  (via drill 0.61)
  Top 0.254: v21.84,24.13 21.59,24.13 20.32,22.86 LED7.2 | v24.64,38.61 24.64,42.16 22.86,43.94 22.86,44.7 LED6.5
  Bottom 0.254: v21.84,24.13 21.84,28.19 22.61,28.96 22.61,31.24 24.64,33.27 v24.64,38.61
N$29
  Top 0.254: LED7.5 27.71,22.84 31.5,19.3 47.75,19.3 48.51,19.81 48.51,21.57 LED8.2
N$30  (via drill 0.61)
  Top 0.254: v48.51,30.73 48.51,26.16 LED8.5 | v53.34,43.69 50.29,46.74 LED5.2
  Bottom 0.254: v48.51,30.73 52.32,34.54 52.32,41.66 53.34,42.67 v53.34,43.69
N$31  (via drill 0.61)
  Top 0.254: v47.5,29.72 46.48,28.7 46.48,26.16 LED8.6 | v52.32,42.93 50.29,44.96 LED5.1
  Bottom 0.254: v47.5,29.72 47.5,31.75 47.24,32 47.24,37.85 v52.32,42.93
N$32
  Top 0.254: LED7.6 26.63,24.93 32,19.81 45.72,19.81 46.23,20.07 46.23,21.54 LED8.1
N$33  (via drill 0.61)
  Top 0.254: v25.65,28.45 22.35,25.15 20.32,25.15 LED7.1 | v29.72,32.51 29.72,37.59 26.16,41.15 26.16,43.43 24.89,44.7 LED6.6
  Bottom 0.254: v29.72,32.51 v25.65,28.45
N$34
  Top 0.254: 48.77,32.51 50.55,32.51 51.05,33.02 53.09,33.02 53.59,32.51 LED1.2 | 48.77,32.51 48.51,32.51 LED1.4 48.77,32.51 | 48.77,32.51 48.77,32.26 45.97,29.46 45.97,28.7 44.7,27.43 37.59,21.34 LED2.3
  Bottom 0.254: LED2.1 37.59,16.26 37.59,21.08 LED2.3
N$35
  Top 0.254: LED3.1 16.26,32.51 21.34,32.51 LED3.3 21.34,32.26 23.11,32.26 32.51,22.86 32.51,21.34 LED2.4
  Bottom 0.254: LED2.2 32.51,16.26 32.51,21.08 LED2.4
N$36  (via drill 0.61)
  Top 0.254: 32.51,48.51 32.51,53.59 LED4.1 | 21.59,38.61 21.59,37.85 21.34,37.59 LED3.4 | 21.59,38.61 21.59,39.12 20.83,39.88 20.32,39.88 19.56,39.12 19.56,36.07 18.8,35.31 18.29,35.31 16.26,37.34 LED3.2 | v29.21,45.21 32.51,48.51 | 21.59,38.61 v23.62,40.64 | 32.51,48.51 LED4.3
  Bottom 0.254: v29.21,45.21 28.19,45.21 v23.62,40.64
N$39
  Top 0.254: B1.AC1 37.34,43.43 41.15,43.43 J11.2
N$40
  Top 0.254: B1.AC2 37.34,40.89 41.15,40.89 J11.1
N$42
  Top 0.254: L2.2 39.37,60.71 U3.18
PG  (via drill 0.61)
  Top 0.254: v40.89,37.85 40.89,36.83 U4.13 | v24.64,29.46 22.35,29.46 21.59,30.23 v13.46,30.23 | v10.92,33.27 v10.92,30.23
  Bottom 0.254: v40.89,37.85 36.58,33.53 28.7,33.53 v24.64,29.46 | v10.92,30.23 v13.46,30.23 | v10.92,33.27 10.92,35.81 10.67,36.07 J2.2 10.41,36.32 9.65,36.32 J1.1
RED  (via drill 0.61)
  Top 0.254: v48.51,43.43 49.53,43.43 51.05,41.91 R7.2 51.31,41.66 52.32,40.64 v53.34,40.64 | v47.24,44.7 45.72,44.7 LED5.6 | v64.26,47.5 62.23,49.53 61.98,49.53 U1.7 | v57.91,37.85 57.91,37.34 57.15,36.58 v55.37,36.58
  Bottom 0.254: v47.24,44.7 v48.51,43.43 | v64.26,47.5 64.26,44.2 v57.91,37.85 | v55.37,36.58 55.37,38.61 v53.34,40.64
RED2  (via drill 0.61)
  Top 0.254: v44.2,35.56 56.9,35.56 58.93,37.59 58.93,38.1 58.67,38.35 58.67,49.53 56.9,51.31 56.13,51.31 U1.11
  Bottom 0.254: v44.2,35.56 44.2,47.5 45.47,48.77 LED9.6
RESET/SBWTDIO  (via drill 0.61)
  Top 0.254: 9.4,36.32 4.83,36.32 J12.2 | 9.4,36.32 9.91,36.32 R1.1 9.4,36.32 | v12.95,45.21 15.49,45.21 U0.7 | 9.4,36.32 v9.4,41.66
  Bottom 0.254: J1.2 7.62,36.32 4.83,36.32 J12.2 | v9.4,41.66 v12.95,45.21
RF_CLK  (via drill 0.61)
  Top 0.254: v12.45,55.88 12.95,55.88 15.49,58.42 20.07,58.42 20.32,58.17 31.5,58.17 U3.9 | v12.45,51.56 13.97,50.04 15.49,50.04 U0.14
  Bottom 0.254: v12.45,51.56 v12.45,55.88
RF_GDO0
  Top 0.254: U3.13 35.31,57.91 35.31,57.15 33.53,55.37 18.03,55.37 15.75,53.09 U0.19
RF_GDO2
  Top 0.254: U3.14 36.32,57.91 36.32,57.15 34.04,54.86 18.8,54.86 16.51,52.58 15.75,52.58 U0.18
RF_SIMO
  Top 0.254: U3.11 33.27,57.91 33.27,57.15 32.51,56.39 14.22,56.39 8.64,50.8 8.64,50.29 8.38,50.04 7.37,50.04 U0.25
RF_SOMI  (via drill 0.61)
  Top 0.254: v19.81,57.4 20.32,56.9 32,56.9 32.51,57.4 32.51,57.91 U3.10 | v15.49,54.36 14.73,55.12 13.97,55.12 9.14,50.29 9.14,50.04 8.38,49.28 7.37,49.28 U0.26
  Bottom 0.254: v19.81,57.4 16.76,54.36 v15.49,54.36
SBWTCK  (via drill 0.61)
  Top 0.254: v16.26,39.12 16.26,40.89 15.75,41.4 U0.1
  Bottom 0.254: v16.26,39.12 13.21,36.07 13.21,34.29 11.18,32.26 6.86,32.26 5.59,33.53 4.83,33.53 J12.3
VBLUE_SCALED  (via drill 0.61)
  Top 0.254: R3.1 44.2,54.61 R4.2 42.67,54.61 40.89,52.83 40.39,52.83 39.12,51.56 v39.12,45.97 | v24.13,28.19 22.86,28.19 21.34,29.72 20.83,29.72 v12.95,21.84 | v4.83,45.72 6.35,47.24 7.11,47.24 U0.29
  Bottom 0.254: v39.12,45.97 32.77,39.62 29.97,39.62 25.65,35.31 25.65,31.75 23.62,29.72 23.62,28.7 v24.13,28.19 | v12.95,21.84 10.16,21.84 5.08,26.92 3.56,26.92 2.03,28.45 2.03,41.4 4.83,44.2 v4.83,45.72
VDCOUP1
  Top 0.254: C6.1 27.43,61.21 29.72,61.21 30.23,60.71 30.73,60.71 U3.7
VDCOUP2
  Top 0.254: C4.1 40.39,58.17 39.12,56.9 38.1,56.9 37.59,57.4 37.59,57.91 U3.15
VGREEN_SCALED  (via drill 0.61)
  Top 0.254: R5.1 44.2,52.07 42.93,52.07 R6.2 42.67,52.07 v42.67,53.34 | v29.46,51.82 v30.99,53.34 | v17.27,47.75 16.76,47.24 15.75,47.24 U0.10
  Bottom 0.254: v42.67,53.34 38.86,53.34 37.85,52.32 32,52.32 v30.99,53.34 | v29.46,51.82 20.83,51.82 17.27,48.26 v17.27,47.75
VIN  (via drill 0.61)
  Top 0.254: v51.82,54.61 54.36,54.61 C1.1 | U4.8 40.89,32.51 40.89,31.24 C3.1 40.64,31.24 35.31,31.75 | 37.85,33.78 37.85,34.29 U4.3 37.85,34.54 37.85,35.05 U4.2 | 37.85,33.78 37.34,33.78 36.83,33.27 | 35.31,31.75 36.83,33.27 | 37.85,33.78 U4.4 | 35.31,31.75 C11.1 | LED6.3 20.83,49.53 22.61,49.53 LED6.2 22.86,49.53 24.64,49.53 LED6.1 24.89,49.28 24.89,48.26 29.72,43.43 29.97,43.43 | 37.85,46.48 37.85,48.51 LED4.4 37.59,48.51 37.59,53.59 LED4.2 | 37.85,46.48 34.8,43.43 31.24,43.43 B1.+ 30.99,43.43 29.97,43.43 | 37.85,46.48 R11.2 | 36.83,33.27 29.97,40.13 29.97,43.43
  Bottom 0.254: v51.82,54.61 38.86,54.61 37.85,53.59 LED4.2 | LED10.1 20.83,49.53 22.61,49.53 LED10.2 22.86,49.53 24.64,49.53 LED10.3 24.89,49.28 29.97,49.28 32,47.24 36.32,47.24 37.59,48.51 LED4.4
VIN_SCALED  (via drill 0.61)
  Top 0.254: 34.8,46.48 36.07,46.48 R11.1 | 34.8,46.48 34.04,46.48 R12.2 | v14.22,54.1 13.72,54.1 11.43,51.82 11.43,49.78 8.38,46.74 7.37,46.74 U0.30 | 34.8,46.48 v33.27,44.96
  Bottom 0.254: v14.22,54.1 14.22,52.32 16.26,50.29 16.26,45.47 17.02,44.7 18.29,44.7 19.81,46.23 32,46.23 v33.27,44.96
VRED_SCALED  (via drill 0.61)
  Top 0.254: R7.1 49.53,41.91 47.5,41.91 R8.2 47.24,41.66 44.7,39.12 v42.67,39.12 | v30.23,38.35 29.46,39.12 29.46,42.42 25.15,46.74 15.75,46.74 U0.9
  Bottom 0.254: v30.23,38.35 30.99,39.12 v42.67,39.12
VWHITE_SCALED  (via drill 0.61)
  Top 0.254: R10.2 56.64,40.89 R9.1 49.53,39.37 48.77,38.61 43.94,38.61 v43.18,37.85 | v28.7,47.75 v30.73,49.78 | v17.27,45.72 16.76,45.72 16.51,45.97 15.75,45.97 U0.8
  Bottom 0.254: v43.18,37.85 43.18,38.35 43.69,38.86 43.69,43.94 37.85,49.78 v30.73,49.78 | v28.7,47.75 28.19,47.75 27.43,46.99 18.54,46.99 v17.27,45.72
(copper drawn outside any net)
  shapes: Bottom area x1